# Altium schematic sheet EPS Stack Header.SchDoc: EPS stack header
size Letter; SheetNumber: 20
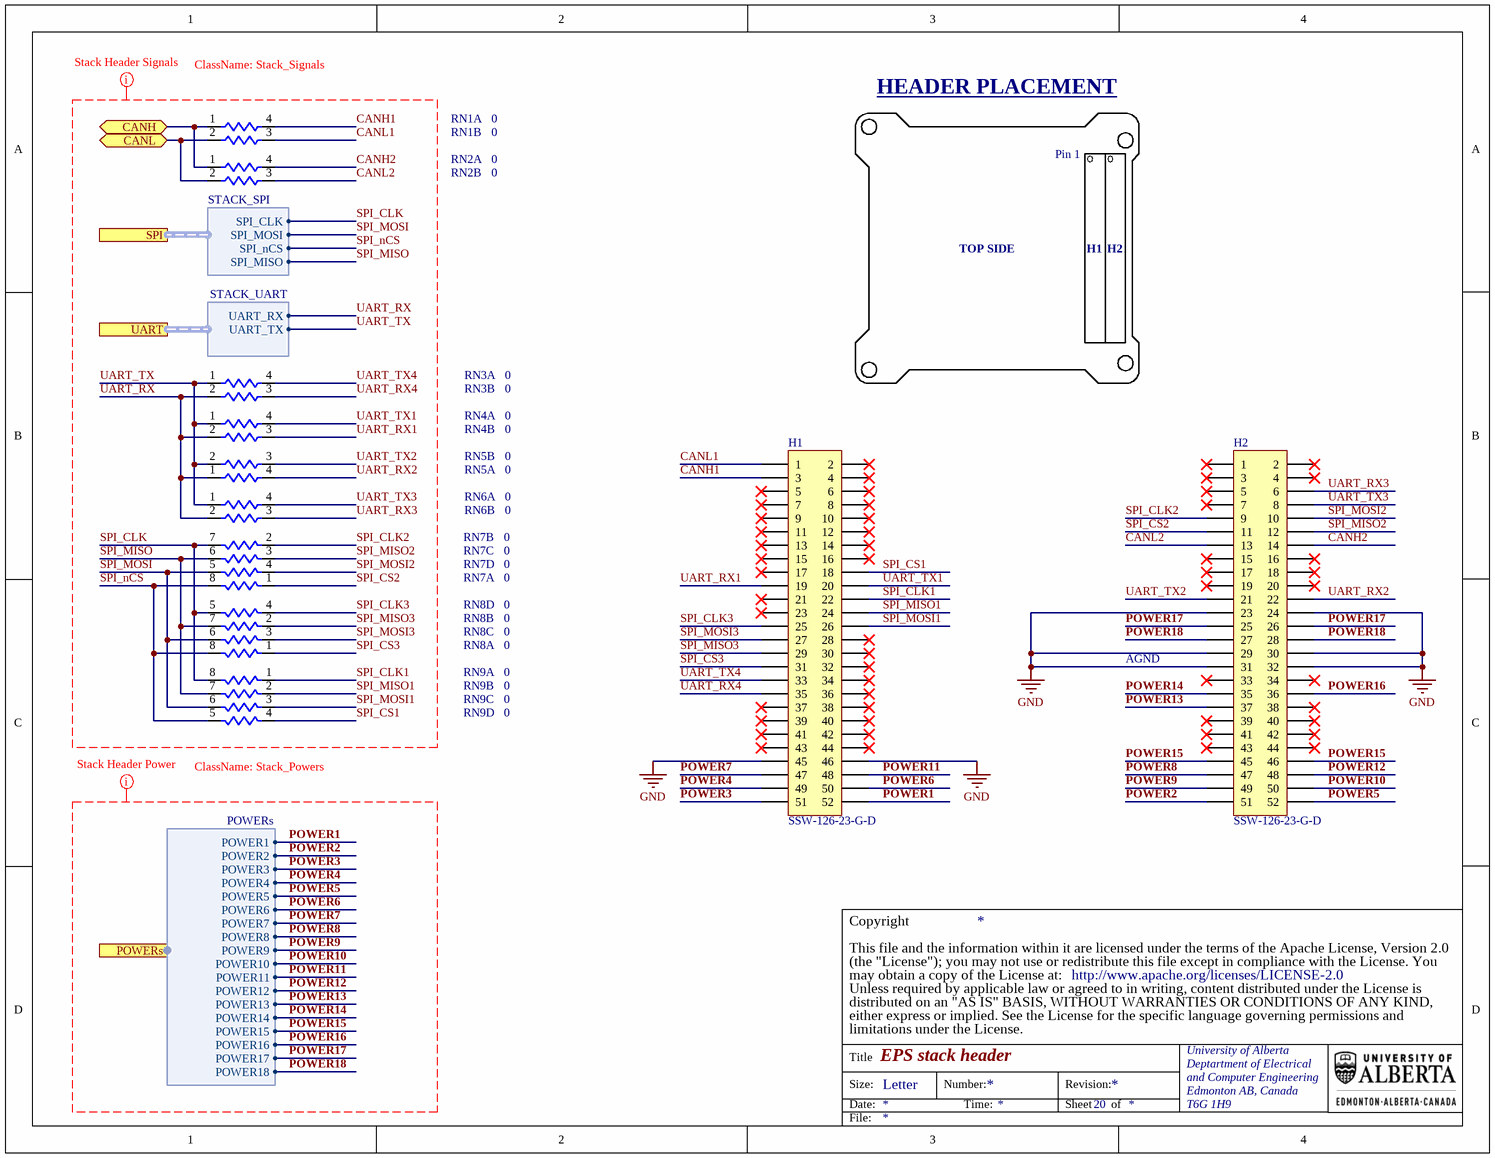
[diagram p0: EPS Stack Header.SchDoc]

## Parts
H1  SSW-126-23-G-D  [SSW-126-23-G-D]
H2  SSW-126-23-G-D  [SSW-126-23-G-D]
RN1  value 0  [PANA-EXB24V]  (hidden comment: Res2 Pack1)  (parts A,B of 2)
RN2  value 0  [PANA-EXB24V]  (hidden comment: Res2 Pack1)  (parts A,B of 2)
RN3  value 0  [PANA-EXB24V]  (hidden comment: Res2 Pack1)  (parts A,B of 2)
RN4  value 0  [PANA-EXB24V]  (hidden comment: Res2 Pack1)  (parts A,B of 2)
RN5  value 0  [PANA-EXB24V]  (hidden comment: Res2 Pack1)  (parts A,B of 2)
RN6  value 0  [PANA-EXB24V]  (hidden comment: Res2 Pack1)  (parts A,B of 2)
RN7  value 0  [PANA-EXB28V]  (hidden comment: Res4 Pack1)  (parts A,B,C,D of 4)
RN8  value 0  [PANA-EXB28V]  (hidden comment: Res4 Pack1)  (parts A,B,C,D of 4)
RN9  value 0  [PANA-EXB28V]  (hidden comment: Res4 Pack1)  (parts A,B,C,D of 4)

## Ports
CANH (bidir), CANL (bidir), POWERs (harness POWERs), SPI (harness STACK_SPI), UART (harness STACK_UART)

## Harnesses
STACK_SPI: SPI_MOSI, SPI_MISO, SPI_CLK, SPI_nCS
STACK_UART: UART_RX, UART_TX
POWERs: POWER1, POWER2, POWER3, POWER4, POWER5, POWER6, POWER7, POWER8, POWER9, POWER10, POWER11, POWER12, POWER13, POWER14, POWER15, POWER16, POWER17, POWER18

## Nets
GND: H1.45 H1.46 H2.23 H2.24 H2.29 H2.30 H2.31 H2.32
CANH: RN1.1 RN2.1 ; port CANH
CANH1: H1.3 RN1.4
CANH2: H2.14 RN2.4
CANL: RN1.2 RN2.2 ; port CANL
CANL1: H1.1 RN1.3
CANL2: H2.13 RN2.3
POWER1: H1.52 ; port POWERs.POWER1
POWER2: H2.51 ; port POWERs.POWER2
POWER3: H1.51 ; port POWERs.POWER3
POWER4: H1.49 ; port POWERs.POWER4
POWER5: H2.52 ; port POWERs.POWER5
POWER6: H1.50 ; port POWERs.POWER6
POWER7: H1.47 ; port POWERs.POWER7
POWER8: H2.47 ; port POWERs.POWER8
POWER9: H2.49 ; port POWERs.POWER9
POWER10: H2.50 ; port POWERs.POWER10
POWER11: H1.48 ; port POWERs.POWER11
POWER12: H2.48 ; port POWERs.POWER12
POWER13: H2.37 ; port POWERs.POWER13
POWER14: H2.35 ; port POWERs.POWER14
POWER15: H2.45 H2.46 ; port POWERs.POWER15
POWER16: H2.36 ; port POWERs.POWER16
POWER17: H2.25 H2.26 ; port POWERs.POWER17
POWER18: H2.27 H2.28 ; port POWERs.POWER18
SPI_CLK: RN7.7 RN8.5 RN9.8 ; port SPI.SPI_CLK
SPI_CLK1: H1.22 RN9.1
SPI_CLK2: H2.9 RN7.2
SPI_CLK3: H1.25 RN8.4
SPI_CS1: H1.18 RN9.4
SPI_CS2: H2.11 RN7.1
SPI_CS3: H1.31 RN8.1
SPI_MISO: RN7.6 RN8.7 RN9.7 ; port SPI.SPI_MISO
SPI_MISO1: H1.24 RN9.2
SPI_MISO2: H2.12 RN7.3
SPI_MISO3: H1.29 RN8.2
SPI_MOSI: RN7.5 RN8.6 RN9.6 ; port SPI.SPI_MOSI
SPI_MOSI1: H1.26 RN9.3
SPI_MOSI2: H2.10 RN7.4
SPI_MOSI3: H1.27 RN8.3
SPI_nCS: RN7.8 RN8.8 RN9.5 ; port SPI.SPI_nCS
UART_RX: RN3.2 RN4.2 RN5.1 RN6.2 ; port UART.UART_RX
UART_RX1: H1.19 RN4.3
UART_RX2: H2.22 RN5.4
UART_RX3: H2.6 RN6.3
UART_RX4: H1.35 RN3.3
UART_TX: RN3.1 RN4.1 RN5.2 RN6.1 ; port UART.UART_TX
UART_TX1: H1.20 RN4.4
UART_TX2: H2.21 RN5.3
UART_TX3: H2.8 RN6.4
UART_TX4: H1.33 RN3.4

Not connected (* = marked no-connect by the designer): H1 2* 4* 5* 6* 7* 8* 9* 10* 11* 12* 13* 14* 15* 16* 17* 21* 23* 28* 30* 32* 34* 36* 37* 38* 39* 40* 41* 42* 43* 44*; H2 1* 2* 3* 4* 5* 7* 15* 16* 17* 18* 19* 20* 33* 34* 38* 39* 40* 41* 42* 43* 44*

## Layout directives
net class Stack_Signals: CANH1, CANH2, CANL1, CANL2, SPI_CLK, SPI_CLK1, SPI_CLK2, SPI_CLK3, SPI_CS1, SPI_CS2, SPI_CS3, SPI_MISO, SPI_MISO1, SPI_MISO2, SPI_MISO3, SPI_MOSI, SPI_MOSI1, SPI_MOSI2, SPI_MOSI3, SPI_nCS, UART_RX, UART_RX1, UART_RX2, UART_RX3, UART_RX4, UART_TX, UART_TX1, UART_TX2, UART_TX3, UART_TX4
net class Stack_Powers: POWER1, POWER2, POWER3, POWER4, POWER5, POWER6, POWER7, POWER8, POWER9, POWER10, POWER11, POWER12, POWER13, POWER14, POWER15, POWER16, POWER17, POWER18

## Notes on the sheet
- HEADER PLACEMENT
- Pin 1
- TOP SIDE
- H1
- H2
- AGND
- (the "License"); you may not use or redistribute this file except in compliance with the License. You
- This file and the information within it are licensed under the terms of the Apache License, Version 2.0
- Copyright
- Unless required by applicable law or agreed to in writing, content distributed under the License is
- distributed on an "AS IS" BASIS, WITHOUT WARRANTIES OR CONDITIONS OF ANY KIND,
- either express or implied. See the License for the specific language governing permissions and
- limitations under the License.
- may obtain a copy of the License at:
- http://www.apache.org/licenses/LICENSE-2.0
- Title
- Size:
- Date:
- Letter
- Number:
- Time:
- Revision:
- Sheet
- of
- University of Alberta
- Deptartment of Electrical
- and Computer Engineering
- Edmonton AB, Canada
- T6G 1H9
- File:

## Library data of the parts
H1 H2 = PP-SAM-00002: Index: 3; Designator: P?; Part Number: PP-SAM-00002; Manufacturer Part Number: SSW-126-23-G-D; Supplier Part Number 1: SSW-126-23-G-D; Supplier 1: Samtec; Publisher: AlbertaSat; Published: 2018-06-07; LatestRevisionDate: 2018-06-07; LatestRevisionNote: ...; Supplier Link: #https://www.samtec.com/products/ssw-126-23-g-d#; Operating Temperature: -55°C ~ 125°C
RN1-RN6 = 20039: RES ARRAY 2 RES ZERO OHM 0404; Part Number: 20039; Manufacturer Part Number: EXB-24VR000X; Sim Note: Enter the Resistance value into parameter field.; Designator: RN?; Tolerance: Jumper; Power: 62.5mW; Code_JEDEC: MS-012-AC; Supplier Part Number 1: Y5000CT-ND; Supplier 1: Digi-Key; Supplier Link: #https://www.digikey.ca/en/products/detail/panasonic-electronic-components/EXB-24VR000X/524613#; PackageReference: 0404 (1010 Metric), Convex; PackageDescription: Chip Array, Flat, 4-Leads, Pitch 0.65mm,  Body 1.00x1.00mm,  IPC Low Density; Type: Jumper; Operating Temperature: -55°C ~ 125°C; Supplier 2: Mouser; Supplier Part Number 2: 667-EXB-24VR000X
RN7-RN9 = 19874: RES ARRAY 4 RES ZERO OHM 0804; Part Number: 19874; Manufacturer Part Number: EXB-28VR000X; Sim Note: Enter the Resistance value into parameter field.; Designator: RN?; Tolerance: Jumper; Power: 62.5mW; Code_JEDEC: MS-012-AC; Supplier Part Number 1: Y7000CT-ND; Supplier 1: Digi-Key; Supplier Link: http://www.digikey.ca/product-search/en?keywords=Y7000CT-ND; PackageReference: 0804, Convex, Long Side Terminals; Temperature Coefficient: -; Type: Jumper; Operating Temperature: -55°C ~ 125°C